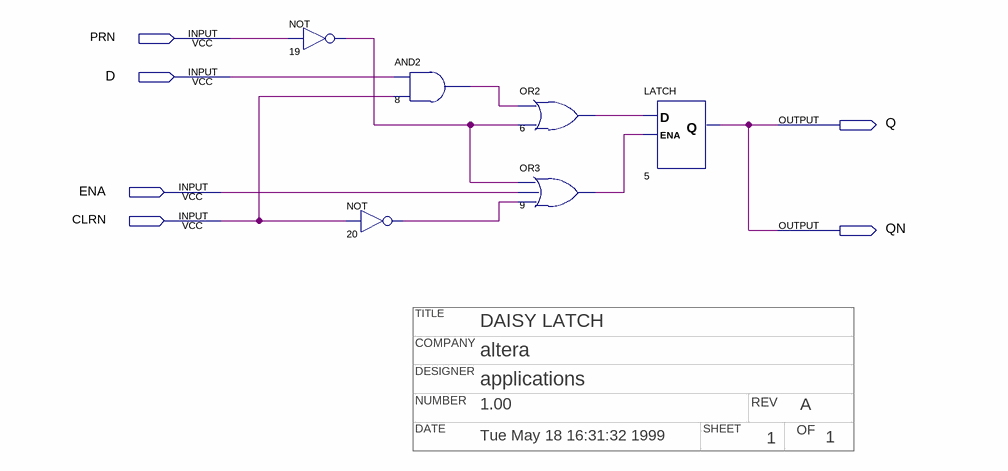
[diagram p0: schematic sheet]
// Quartus schematic rdlatch.bdf as structural Verilog: 6 symbols, 6 pins
// Title block: TITLE: DAISY LATCH; COMPANY: altera; DESIGNER: applications; NUMBER: 1.00; REV: A; DATE: Tue May 18 16:31:32 1999; SHEET: 1; OF: 1
module rdlatch (
  input  PRN,
  input  D,
  input  ENA,
  input  CLRN,
  output Q,
  output QN
);

  wire n6_out, n8_out, n9_out, n19_out, n20_out;

  not u_19 (n19_out, PRN);
  not u_20 (n20_out, CLRN);
  and u_8 (n8_out, D, CLRN);
  or u_6 (n6_out, n8_out, n19_out);
  or u_9 (n9_out, n19_out, ENA, n20_out);
  LATCH u_5 (.D(n6_out), .ENA(n9_out), .Q(Q));

  assign QN = Q;
endmodule
